# EAGLE design C64_Userport_Test (EAGLE 9.5.2)
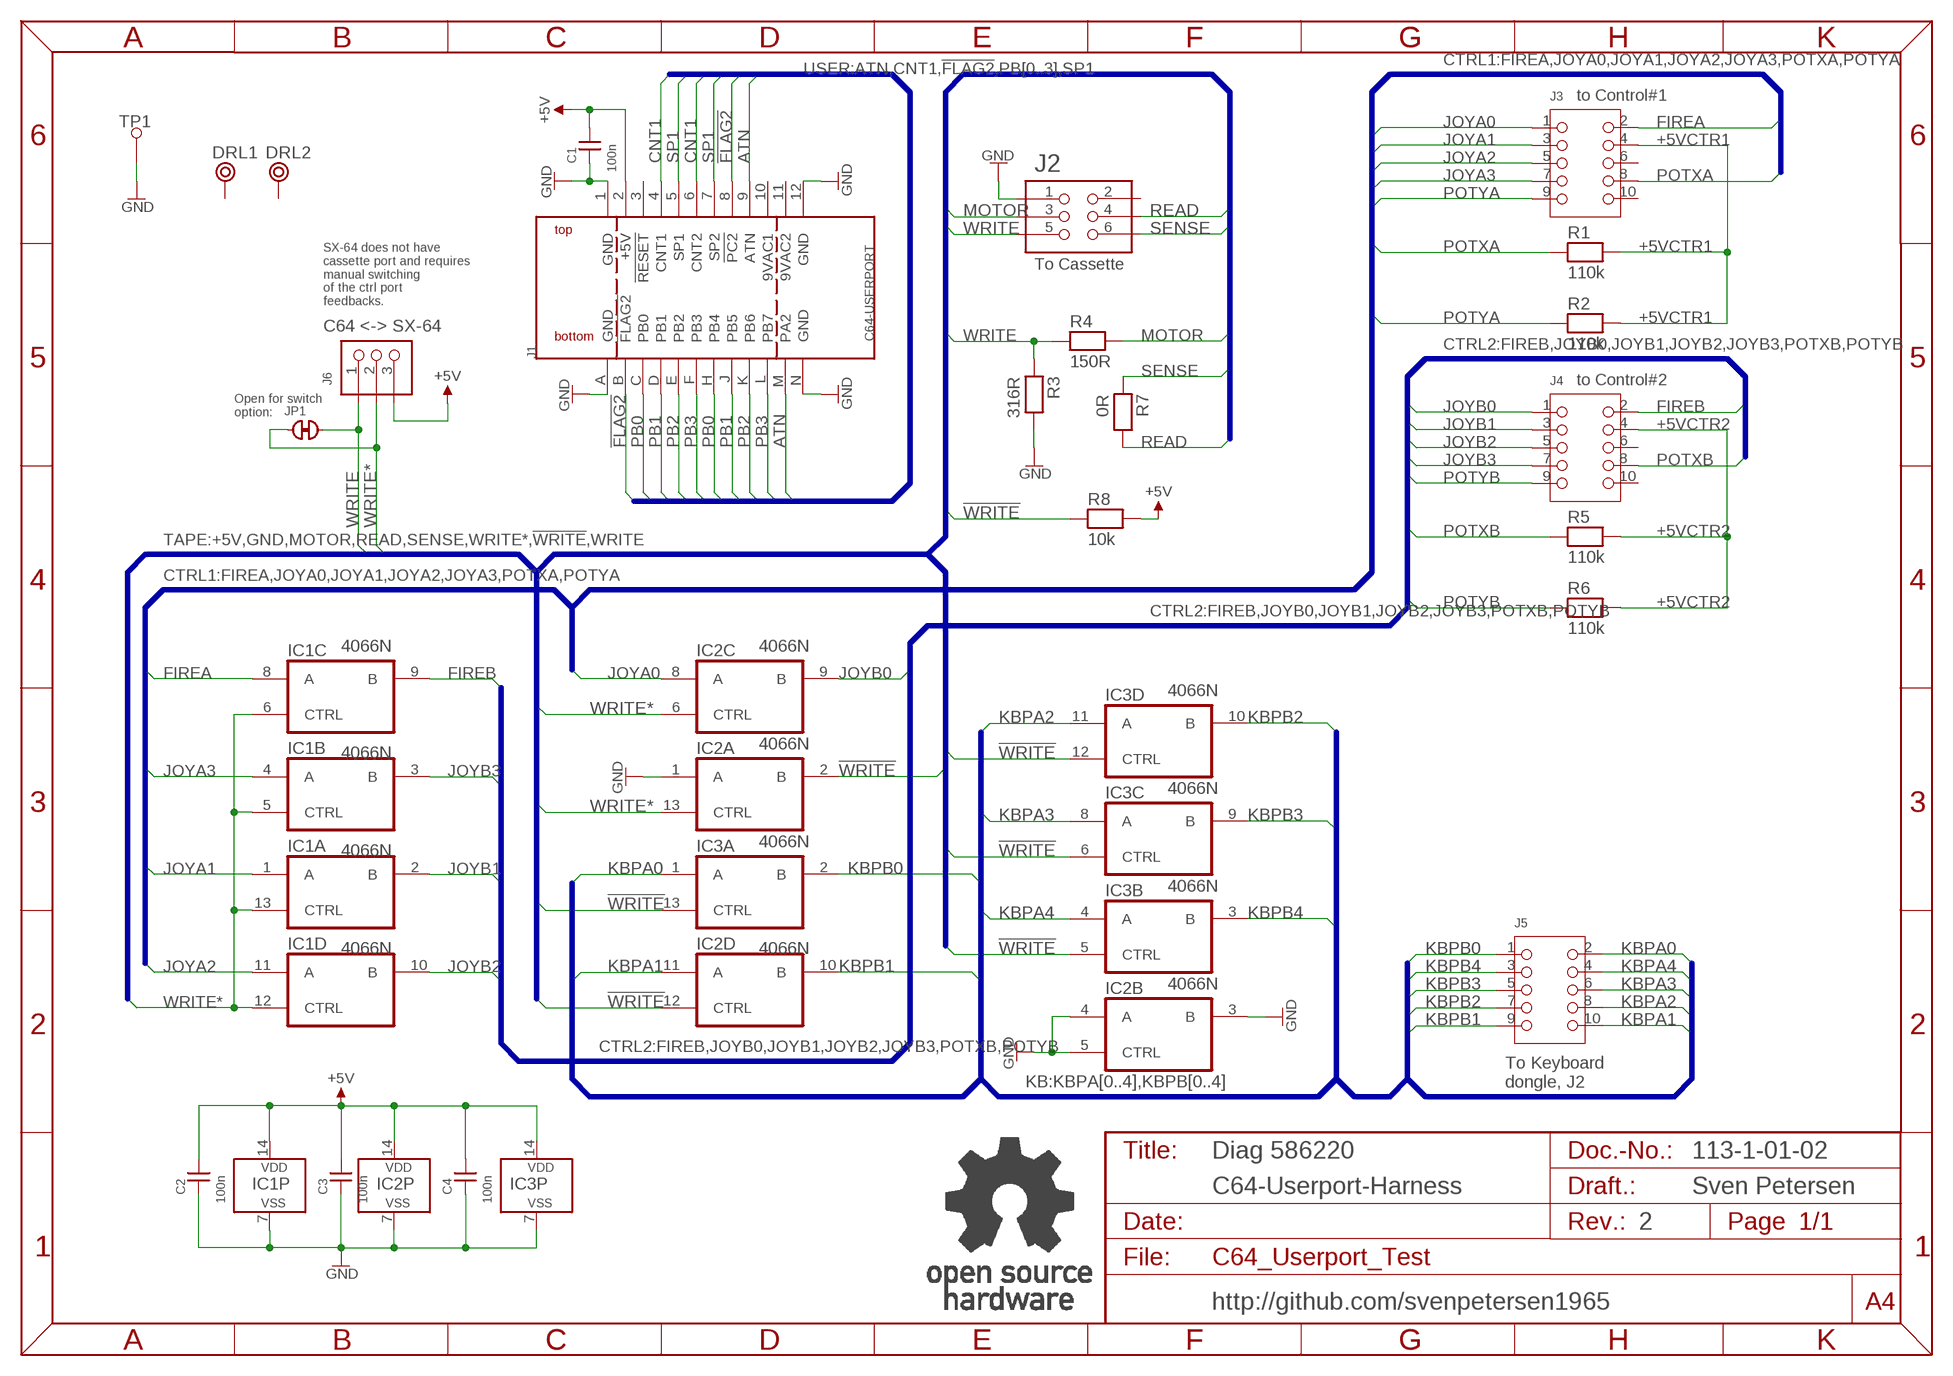
[diagram p0: schematic, sheet 1]

## Parts
C1  100n  CAP01  [C-2,5]
C2  100n  CAP01  [C-2,5]
C3  100n  CAP01  [C-2,5]
C4  100n  CAP01  [C-2,5]
DRL1  BOHR3,2  [BOHR3,2]
DRL2  BOHR3,2  [BOHR3,2]
IC1  4066N  [DIL14]
IC2  4066N  [DIL14]
IC3  4066N  [DIL14]
J1  C64-USERPORT  [USERPORT]
J2  2X03WV  [2X03WV]
J3  2X05WV  [2X05WV]
J4  2X05WV  [2X05WV]
J5  2X05WV  [2X05WV]
J6  PINHD-1X3  [1X03]
JP1  CLOSED  [CP_CL]
R1  110k  RES04  [R-10]
R2  110k  RES04  [R-10]
R3  316R  RES04  [R-10]
R4  150R  RES04  [R-10]
R5  110k  RES04  [R-10]
R6  110k  RES04  [R-10]
R7  0R  RES04  [R-10]
R8  10k  RES04  [R-10]
TP1  L1,2_R  [1,2MM_R]
U$20  OPEN_SOURCE_HW  [OPENHW]

## Nets
!FLAG2: J1.8(!PC2) J1.B(!FLAG2)
!WRITE: IC2.2(A:B) IC2.12(D:CTRL) IC3.5(B:CTRL) IC3.6(C:CTRL) IC3.12(D:CTRL) IC3.13(A:CTRL) R8.1
+5V: C1.2 C2.2 C3.2 C4.2 IC1.14(P:VDD) IC2.14(P:VDD) IC3.14(P:VDD) J1.2(+5V) J6.3 R8.2
+5VCTR1: J3.4 R1.2 R2.2
+5VCTR2: J4.4 R5.2 R6.2
ATN: J1.9(ATN) J1.M(PA2)
CNT1: J1.4(CNT1) J1.6(CNT2)
FIREA: IC1.8(C:A) J3.2
FIREB: IC1.9(C:B) J4.2
GND: C1.1 C2.1 C3.1 C4.1 IC1.7(P:VSS) IC2.1(A:A) IC2.3(B:B) IC2.4(B:A) IC2.5(B:CTRL) IC2.7(P:VSS) IC3.7(P:VSS) J1.1(GND) J1.12(GND) J1.A(GND) J1.N(GND) J2.1 R3.2 TP1.1
JOYA0: IC2.8(C:A) J3.1
JOYA1: IC1.1(A:A) J3.3
JOYA2: IC1.11(D:A) J3.5
JOYA3: IC1.4(B:A) J3.7
JOYB0: IC2.9(C:B) J4.1
JOYB1: IC1.2(A:B) J4.3
JOYB2: IC1.10(D:B) J4.5
JOYB3: IC1.3(B:B) J4.7
KBPA0: IC3.1(A:A) J5.2
KBPA1: IC2.11(D:A) J5.10
KBPA2: IC3.11(D:A) J5.8
KBPA3: IC3.8(C:A) J5.6
KBPA4: IC3.4(B:A) J5.4
KBPB0: IC3.2(A:B) J5.1
KBPB1: IC2.10(D:B) J5.9
KBPB2: IC3.10(D:B) J5.7
KBPB3: IC3.9(C:B) J5.5
KBPB4: IC3.3(B:B) J5.3
MOTOR: J2.3 R4.2
PB0: J1.C(PB0) J1.H(PB4)
PB1: J1.D(PB1) J1.J(PB5)
PB2: J1.E(PB2) J1.K(PB6)
PB3: J1.F(PB3) J1.L(PB7)
POTXA: J3.8 R1.1
POTXB: J4.8 R5.1
POTYA: J3.9 R2.1
POTYB: J4.9 R6.1
READ: J2.4 R7.2
SENSE: J2.6 R7.1
SP1: J1.5(SP1) J1.7(SP2)
WRITE: J2.5 J6.1 JP1.2 R3.1 R4.1
WRITE*: IC1.5(B:CTRL) IC1.6(C:CTRL) IC1.12(D:CTRL) IC1.13(A:CTRL) IC2.6(C:CTRL) IC2.13(A:CTRL) J6.2 JP1.1
Unconnected: DRL1.P$1 DRL2.P$1 J1.3(!RESET) J2.2 J3.6 J3.10 J4.6 J4.10

## Buses
USER:ATN,CNT1,!FLAG2,PB[0..3],SP1
TAPE:+5V,GND,MOTOR,READ,SENSE,WRITE*,!WRITE,WRITE
CTRL1:FIREA,JOYA0,JOYA1,JOYA2,JOYA3,POTXA,POTYA
CTRL2:FIREB,JOYB0,JOYB1,JOYB2,JOYB3,POTXB,POTYB
KB:KBPA[0..4],KBPB[0..4]

## Notes on the sheet
- to Control#1
- To Cassette
- SX-64 does not have
  cassette port and requires
  manual switching
  of the ctrl port
  feedbacks.
- C64 <-> SX-64
- to Control#2
- Open for switch
  option:
- To Keyboard
  dongle, J2
- Diag 586220 | 113-1-01-02
- C64-Userport-Harness | Sven Petersen
- 2
- http://github.com/svenpetersen1965

## Power pins joined to a net without a drawn wire
9VAC1: J1.10(9VAC1)
9VAC2: J1.11(9VAC2)

## Library data of the parts
C1-C4 = DISCRETE:CAP01
DRL1 DRL2 = Mech_Bohr:BOHR3,2
IC1-IC3 = 40xx:4066: Quad bilateral ANALOG SWITCH
J1 = Commodore:C64-USERPORT
J2 = PINHEAD:2X03WV
J3-J5 = PINHEAD:2X05WV
J6 = PINHEAD:PINHD-1X3
JP1 = Cutpad:CLOSED: Closed Cutpad
R1-R8 = DISCRETE:RES04
TP1 = Pads:L1,2_R
U$20 = Logo:OPEN_SOURCE_HW

## Board
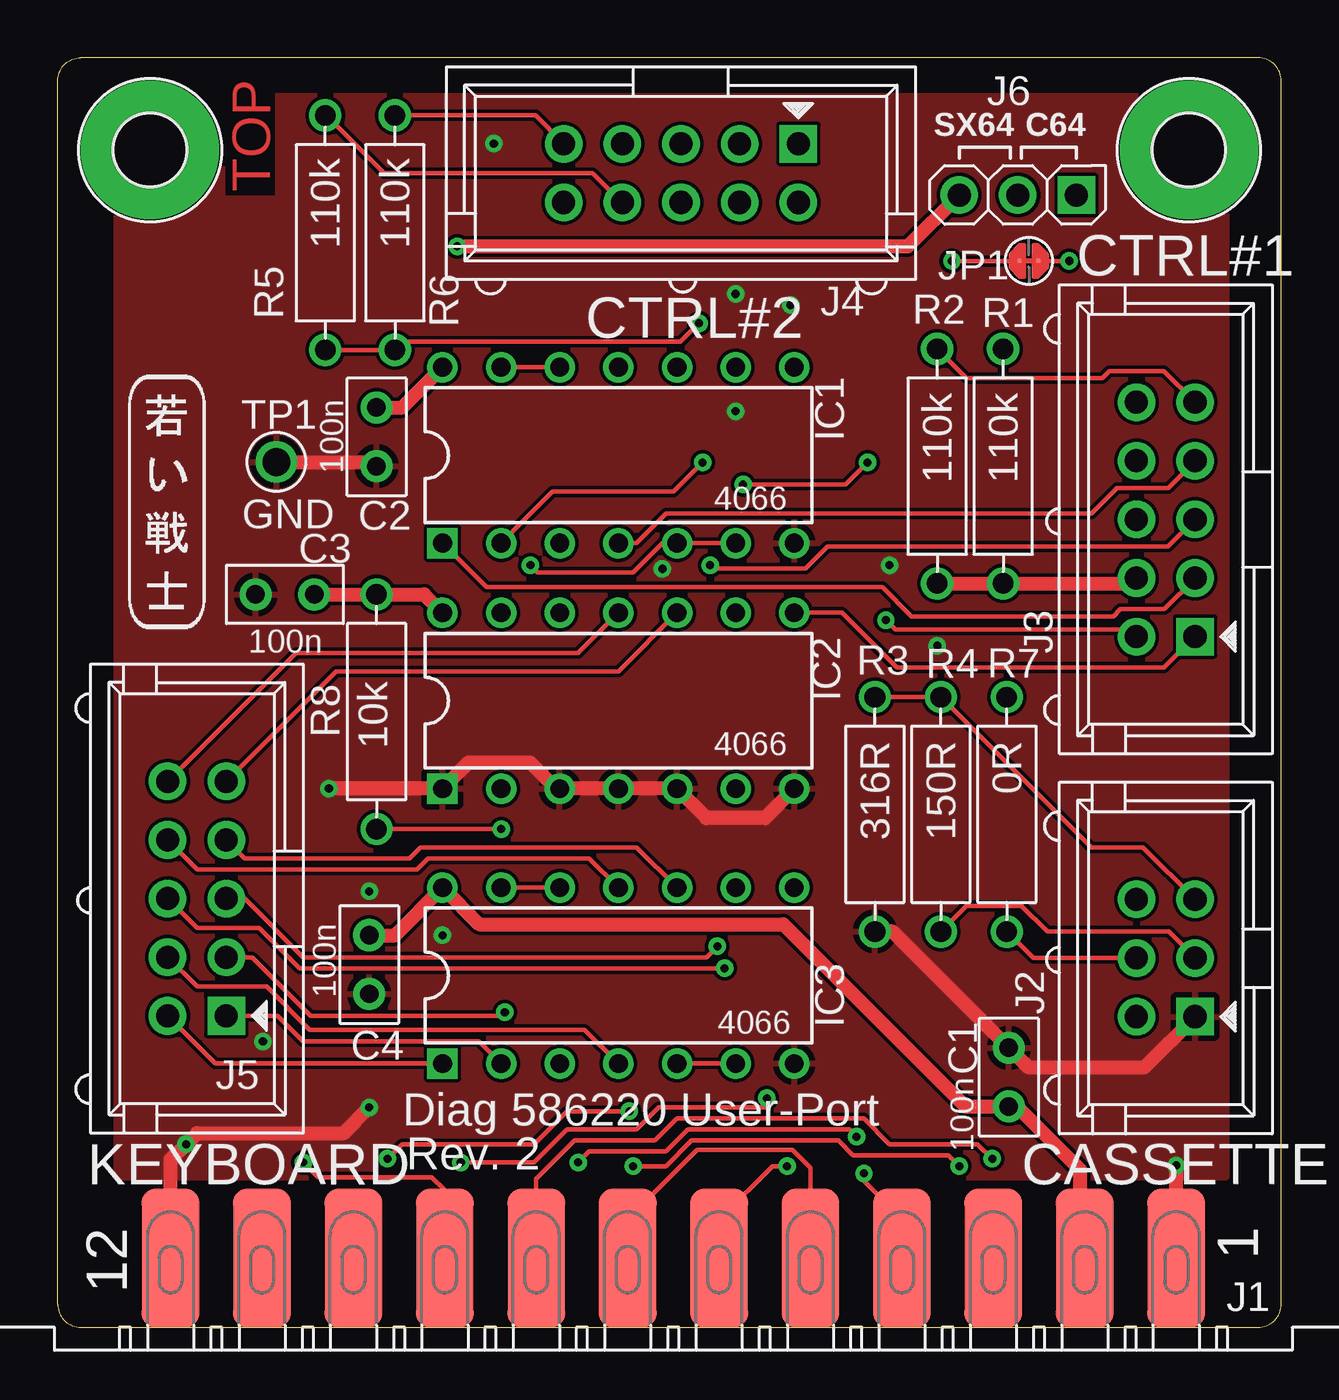
[diagram p1: board, top side]
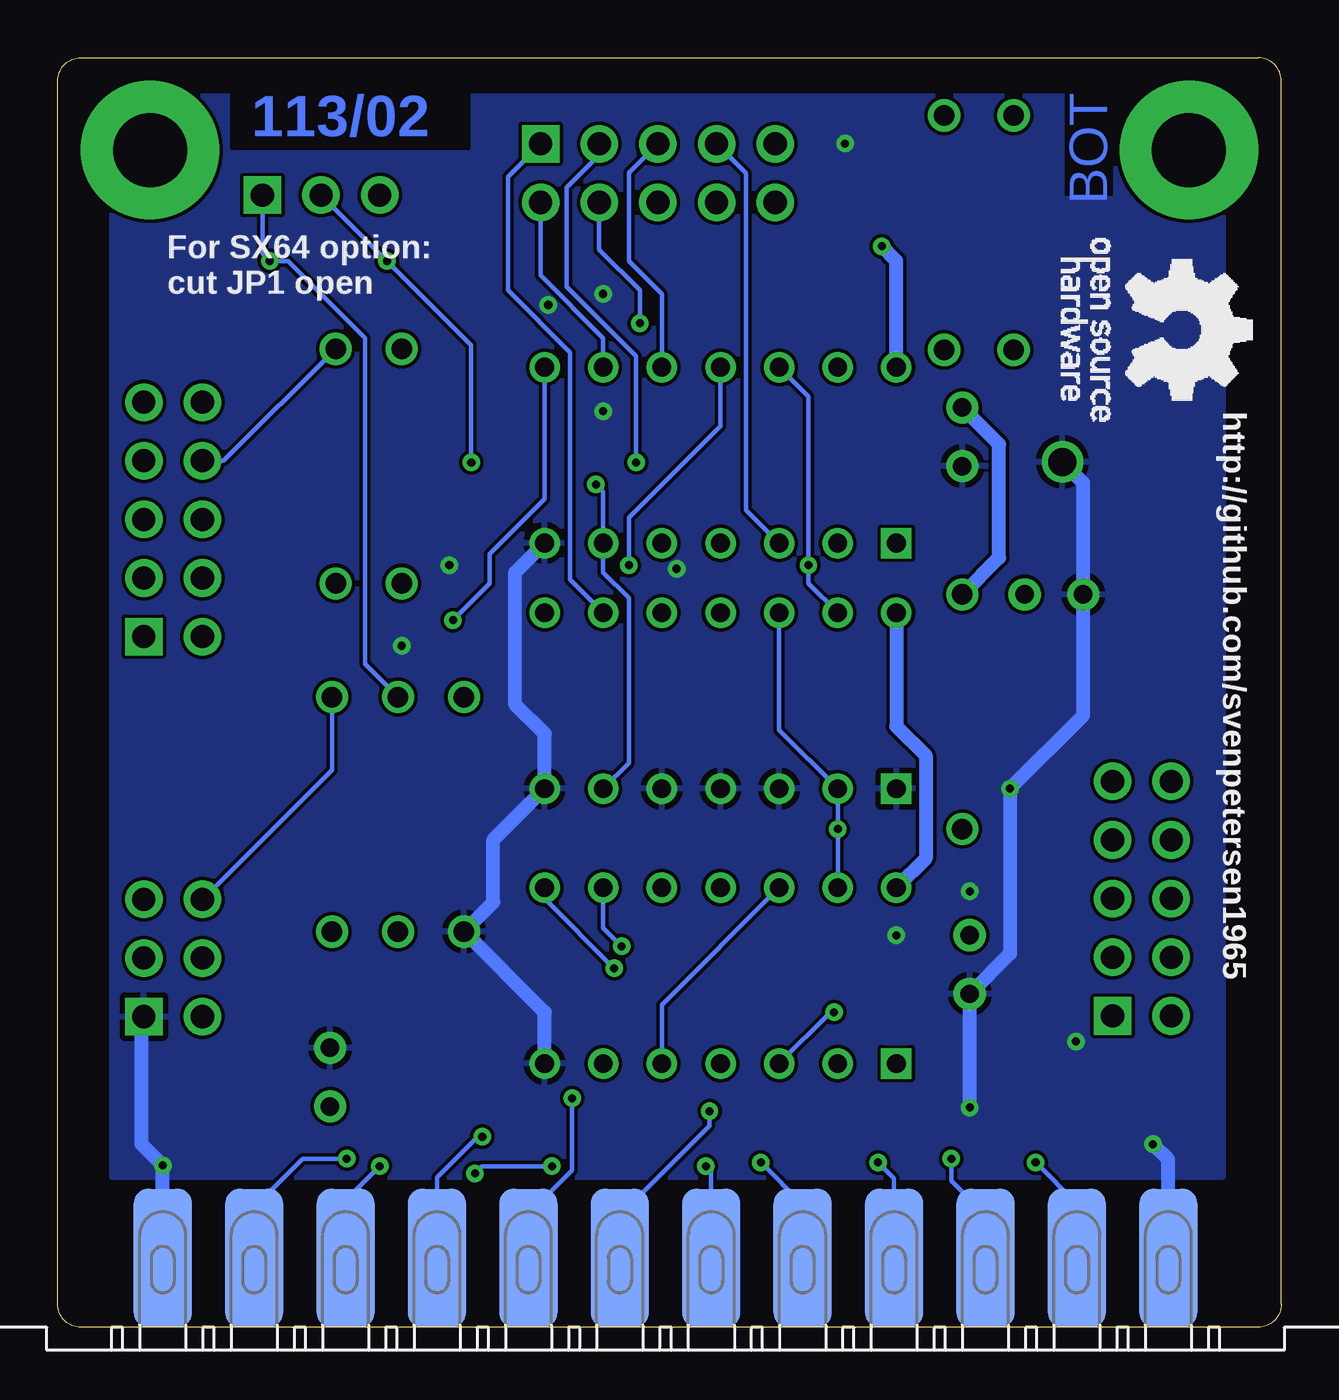
[diagram p2: board, bottom side, seen from below]

Size 53 x 55 mm. Coordinates in mm from the lower left corner, seen from the top.
Outline: 0,1 0,54 arc-90 1,55 52,55 arc-90 53,54 53,1 arc-90 52,0 1,0 arc-90 0,1
Copper layers (1*16): Top 0.035mm / dielectric 1.5mm / Bottom 0.035mm
Design rules "default *": minimum track width 6mil, minimum drill 0.35mm, track to track 6mil, track to pad 6mil, pad to pad 6mil, via to via 6mil, smd to smd 6mil, copper to edge 40mil, drill to drill 6mil, minimum pad ring 10mil, minimum via ring 8mil, stop-mask expansion 4mil, vias tented up to drill 24mil, thermal gap 10mil
bRestrict: 3 lines

### Footprints (pad centres in the part's own frame; a part is rotated, then mirrored left to right if it is on the bottom)
C-2,5 = drill 0.8 pad 1.397: 1 -1.27,0; 2 1.27,0
BOHR3,2 = drill 3.2 pad 6: P$1 0,0
DIL14 = drill 0.813 square: 1 -7.62,-3.81 | drill 0.813: 2 -5.08,-3.81; 3 -2.54,-3.81; 4 0,-3.81; 5 2.54,-3.81; 6 5.08,-3.81; 7 7.62,-3.81; 8 7.62,3.81; 9 5.08,3.81; 10 2.54,3.81; 11 0,3.81; 12 -2.54,3.81; 13 -5.08,3.81; 14 -7.62,3.81
USERPORT = smd 2.5 x 6: 1 -21.78,-3; 2 -17.82,-3; 3 -13.86,-3; 4 -9.9,-3; 5 -5.94,-3; 6 -1.98,-3; 7 1.98,-3; 8 5.94,-3; 9 9.9,-3; 10 13.86,-3; 11 17.82,-3; 12 21.78,-3 | smd 2.5 x 6 bottom: A -21.78,-3; B -17.82,-3; C -13.86,-3; D -9.9,-3; E -5.94,-3; F -1.98,-3; H 1.98,-3; J 5.94,-3; K 9.9,-3; L 13.86,-3; M 17.82,-3; N 21.78,-3
2X03WV = drill 1 pad 1.626 square: 1 -2.54,-1.27 | drill 1 pad 1.626: 2 -2.54,1.27; 3 0,-1.27; 4 0,1.27; 5 2.54,-1.27; 6 2.54,1.27
2X05WV = drill 1 pad 1.626 square: 1 -5.08,-1.27 | drill 1 pad 1.626: 2 -5.08,1.27; 3 -2.54,-1.27; 4 -2.54,1.27; 5 0,-1.27; 6 0,1.27; 7 2.54,-1.27; 8 2.54,1.27; 9 5.08,-1.27; 10 5.08,1.27
1X03 = drill 1 pad 1.626 square: 1 -2.54,0 | drill 1 pad 1.626: 2 0,0; 3 2.54,0
CP_CL = smd 0.152 x 0.152: 1 -0.4,0; 2 0.4,0
R-10 = drill 0.889 pad 1.397: 1 -5.08,0; 2 5.08,0
1,2MM_R = drill 1.2: 1 0,0

### Placement (x,y rotation side)
C1  41.2,10.84 270 top
C2  13.81,38.58 90 top
C3  9.84,31.75 0 top
C4  13.49,15.72 90 top
DRL1  4,51 0 top
DRL2  49,51 0 top
IC1  24.29,37.78 0 top
IC2  24.29,27.15 0 top
IC3  24.29,15.24 0 top
J1  26.67,0 180 top
J2  48,16 90 top
J3  48,35 90 top
J4  27,50 180 top
J5  6.03,18.57 90 top
J6  41.59,49.05 180 top
JP1  42.07,46.2 0 top
R1  40.96,37.31 270 top
R2  38.1,37.31 270 top
R3  35.4,22.23 270 top
R4  38.26,22.23 270 top
R5  11.59,47.42 270 top
R6  14.61,47.42 270 top
R7  41.12,22.23 270 top
R8  13.81,26.67 90 top
TP1  9.48,37.49 0 top
U$15  [SVEN_TAG]  4.76,35.88 0 top
U$17  [2LAYER]  9.21,49.21 90 top
U$18  [PCB-TITLE/]  0,64 0 top  (outside the outline)
U$20  9.53,47.15 270 bottom

### Tracks (layer width: path | path; a pad name or v marks a point on that pad's centre or on a via)
!FLAG2  (via drill 0.35)
  Top 0.203: J1.8 20.73,6.44 22.38,8.1 25.88,8.1 26.83,9.05 34.92,9.05 36.04,7.94 39.85,7.94 v40.48,7.3
  Bottom 0.203: v40.48,7.3 42.39,7.3 44.49,5.2 J1.B
!WRITE  (via drill 0.35)
  Top 0.203: IC3.5 IC3.6 | IC3.13 IC3.12 | R8.1 v19.21,21.59
  Bottom 0.203: IC3.12 26.83,13.97 IC3.5 | IC3.13 v19.21,21.59 IC2.2 21.75,25.88 IC2.12
+5V  (via drill 0.35)
  Top 0.61: C4.2 14.61,16.99 IC3.14 18.26,17.46 31.43,17.46 39.33,9.57 C1.2 41.55,9.57 44.29,6.83 44.29,3.2 J1.2 | C2.2 14.92,39.85 IC1.14 | C3.2 R8.2 15.88,31.75 IC2.14 | v17.3,46.83 36.83,46.83 J6.3
  Bottom 0.61: R8.2 12.22,33.34 12.22,38.26 C2.2 | IC2.14 16.67,26.04 15.4,24.77 15.4,20.32 IC3.14 | IC1.14 16.67,46.2 v17.3,46.83
+5VCTR1
  Top 0.61: R2.2 R1.2 46.5,32.23 J3.4
+5VCTR2  (via drill 0.35)
  Top 0.203: R5.2 R6.2 14.97,42.7 26.99,42.7 v27.78,43.5
  Bottom 0.203: v27.78,43.5 27.78,44.93 29.54,46.69 J4.4
ATN  (via drill 0.35)
  Top 0.203: J1.9 16.77,5.93 16.19,6.51 11.27,6.51 v10.64,7.14
  Bottom 0.203: J1.M 8.85,5.36 v10.64,7.14
CNT1  (via drill 0.35)
  Top 0.203: J1.6 28.73,3.08 28.73,4.76 30.96,6.99 v31.59,6.99 | v34.92,6.67 34.92,6.35 36.57,4.71 J1.4
  Bottom 0.203: v31.59,6.99 34.61,6.99 v34.92,6.67
FIREA  (via drill 0.35)
  Top 0.203: J3.2 46.41,30.24 36.28,30.24 v35.88,30.64
  Bottom 0.203: v35.88,30.64 34.29,32.23 34.29,33.5 31.91,35.88 IC1.8
FIREB
  Bottom 0.203: IC1.9 29.37,42.86 32.08,45.57 J4.2
GND  (via drill 0.35)
  Top 0.61: v13.49,9.53 12.38,8.41 6.03,8.41 v5.56,7.94 4.89,7.27 J1.12 | R3.2 36.17,17.14 C1.1 42.04,11.27 47.08,11.27 J2.1 | IC2.7 30.64,22.07 28.1,22.07 IC2.5 IC2.4 IC2.3 21.59,23.34 20.47,24.45 17.79,24.45 IC2.1 v11.75,23.34 | TP1.1 13.63,37.49 C2.1 | J1.A 48.45,6.95 48.42,6.99 v48.45,7.02
  Bottom 0.61: J1.12 4.89,7.27 v5.56,7.94 | v13.49,9.53 C4.1 11.75,16.19 v11.75,23.34 8.57,26.51 C3.1 8.57,36.58 TP1.1 | IC3.7 31.91,13.65 R3.2 34.13,18.41 34.13,21.11 IC2.7 31.91,25.72 33.18,26.99 33.18,32.7 IC1.7 | J1.A v48.45,7.02 49.37,7.94 49.37,13.36 J2.1
  other vias: 13.49,18.89 38.1,29.53 36.04,33.02 16.67,16.99 18.89,51.28 29.37,39.69 29.37,44.77 31.75,44.29 26.19,32.86 8.89,12.38
  pour Top: 2.54,6.51 50.64,6.51 50.64,53.34 2.54,53.34
  pour Bottom: 2.54,6.51 50.64,6.51 50.64,53.34 2.54,53.34
JOYA0
  Top 0.203: IC2.8 33.97,30.96 36.35,28.57 47.92,28.57 J3.1
JOYA1
  Top 0.203: IC1.1 18.57,32.07 35.72,32.07 36.99,30.8 45.72,30.8 46.04,31.11 47.94,31.11 49.27,32.44 J3.3
JOYA2  (via drill 0.35)
  Top 0.203: J3.5 48.08,33.81 33.34,33.81 32.38,32.86 28.42,32.86 v28.26,33.02
  Bottom 0.203: v28.26,33.02 28.26,35.08 24.29,39.05 IC1.11
JOYA3
  Top 0.203: IC1.4 25.08,33.97 26.35,35.24 44.77,35.24 45.88,36.35 48.1,36.35 49.27,37.52 J3.7
JOYB0
  Bottom 0.203: IC2.9 30.8,32.38 30.8,42.23 33.5,44.93 33.5,49.85 J4.1
JOYB1  (via drill 0.35)
  Top 0.203: v27.94,37.47 26.67,36.2 21.43,36.2 IC1.2
  Bottom 0.203: J4.3 29.54,50.79 30.96,49.37 30.96,45.09 27.94,42.07 v27.94,37.47
JOYB2
  Bottom 0.203: IC1.10 26.83,44.77 28.26,46.2 28.26,50.01 J4.5
JOYB3
  Bottom 0.203: J4.7 23.18,49.99 23.18,35.4 IC1.3
KBPA0
  Top 0.203: J5.2 6.83,11.43 IC3.1
KBPA1
  Top 0.203: J5.10 10.32,29.21 22.54,29.21 IC2.11
KBPA2
  Top 0.203: J5.8 6.03,19.84 15.56,19.84 16.03,20.32 23.02,20.32 IC3.11
KBPA3  (via drill 0.35)
  Top 0.203: J5.6 6.03,17.3 8.73,17.3 10.48,15.56 v28.89,15.56
  Bottom 0.203: v28.89,15.56 31.91,18.57 IC3.8
KBPA4
  Top 0.203: J5.4 6.03,14.76 9.05,14.76 10.92,12.9 22.82,12.9 IC3.4
KBPB0
  Top 0.203: J5.1 9.53,13.49 10.64,12.38 18.26,12.38 IC3.2
KBPB1
  Top 0.203: J5.9 12.06,28.42 24.29,28.42 IC2.10
KBPB2
  Top 0.203: J5.7 8.1,20.32 15.24,20.32 15.72,20.8 25.08,20.8 IC3.10
KBPB3  (via drill 0.35)
  Top 0.203: J5.5 8.1,18.57 10.64,16.03 28.1,16.03 v28.57,16.51
  Bottom 0.203: v28.57,16.51 29.37,17.3 IC3.9
KBPB4  (via drill 0.35)
  Top 0.203: J5.3 8.41,16.03 10.95,13.49 19.21,13.49 v19.37,13.65
  Bottom 0.203: v19.37,13.65 19.53,13.65 IC3.3
MOTOR
  Top 0.203: J2.3 48.12,17.14 42.86,17.14 41.75,18.26 39.37,18.26 R4.2
PB0  (via drill 0.35)
  Top 0.203: v24.92,6.99 26.35,6.99 27.46,8.1 33.81,8.1 34.45,7.46 38.58,7.46 v39.05,6.99
  Bottom 0.203: J1.H 24.69,6.75 v24.92,6.99 | v39.05,6.99 40.53,5.51 J1.C
PB1  (via drill 0.35)
  Top 0.203: v22.54,7.14 23.02,7.62 26.35,7.62 27.3,8.57 34.29,8.57 v34.61,8.26
  Bottom 0.203: J1.J 20.73,5.33 v22.54,7.14 | v34.61,8.26 34.81,8.26 36.57,6.49 J1.D
PB2  (via drill 0.35)
  Top 0.203: v30.72,9.92 30.72,9.53 26.04,9.53 25.08,8.57 22.07,8.57 20.64,7.14 v17.46,7.14
  Bottom 0.203: J1.K 16.77,6.45 v17.46,7.14 | v30.72,9.92 30.72,6.8 32.28,5.24 32.54,5.24 32.61,5.17 J1.E
PB3  (via drill 0.35)
  Top 0.203: v24.77,9.37 22.07,9.37 20.64,7.94 14.92,7.94 v14.29,7.3
  Bottom 0.203: J1.L 12.81,4.87 14.29,6.35 v14.29,7.3 | J1.F 28.65,4.85 24.77,8.73 v24.77,9.37
POTXA
  Bottom 0.203: J3.8 45.8,37.54 R1.1
POTXB
  Top 0.203: J4.8 23.18,50.01 14.13,50.01 11.64,52.5 R5.1
POTYA
  Top 0.203: R2.1 39.37,41.12 45.24,41.12 45.56,41.43 47.92,41.43 J3.9
POTYB
  Top 0.203: R6.1 20.69,52.5 J4.9
READ
  Top 0.203: R7.2 42.26,16 J2.4
SENSE
  Bottom 0.203: J2.6 41.12,24.15 R7.1
SP1
  Top 0.203: J1.7 24.69,4.69 27.7,7.7 31.83,7.7 32.61,6.92 J1.5
WRITE  (via drill 0.35)
  Top 0.203: R4.1 38.34,27.23 | 38.34,27.23 44.77,20.8 47.01,20.8 J2.5 | R3.1 R4.1 | R4.1 38.34,27.23 | JP1.2 v43.81,46.2
  Bottom 0.203: R4.1 39.69,28.73 39.69,42.86 40.8,43.97 43.02,46.2 v43.81,46.2 44.13,46.51 J6.1
WRITE*  (via drill 0.35)
  Top 0.203: IC1.6 26.99,33.97 | 26.99,33.97 IC1.5 | IC1.13 IC1.12 | v20.48,33.02 20.8,32.7 24.92,32.7 26.19,33.97 26.99,33.97 | v29.69,36.51 34.13,36.51 v35.08,37.47 | JP1.1 v38.73,46.2
  Bottom 0.203: IC2.6 28.26,24.45 28.26,31.59 29.37,32.7 IC1.6 29.37,36.2 v29.69,36.51 | IC2.13 20.48,32.23 v20.48,33.02 20.48,40.32 IC1.12 | v35.08,37.47 35.08,42.55 v38.73,46.2 J6.2

### Text on the board
Bottom: 113/02
tPlace: SX64 | C64 | CTRL#1 | CTRL#2 | GND | Diag 586220 User-Port | Rev. 2 | KEYBOARD | CASSETTE | 1 | 12
bPlace: For SX64 option: / cut JP1 open | http://github.com/svenpetersen1965
tNames: 110k | 110k | 110k | 110k | 100n | 4066 | 100n | 10k | 4066 | 316R | 150R | 0R | 100n | 4066 | 100n
Document: 113-2-01-02 | Diag 586220 / Harness 2020 | 35µm | 2 | 2